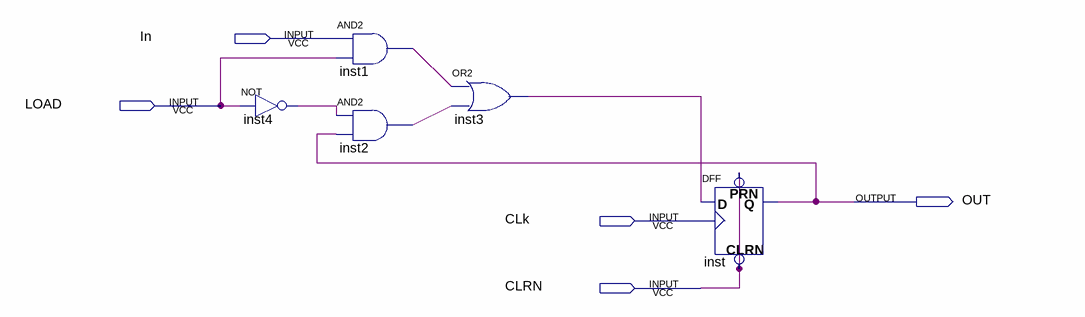
[diagram p0: schematic sheet]
// Quartus schematic onebitreg.bdf as structural Verilog: 5 symbols, 5 pins
module onebitreg (
  input  In,
  input  LOAD,
  input  CLk,
  input  CLRN,
  output OUT
);

  wire inst1_out, inst2_out, inst3_out, inst4_out;

  not inst4 (inst4_out, LOAD);
  and inst1 (inst1_out, In, LOAD);
  and inst2 (inst2_out, inst4_out, OUT);
  or inst3 (inst3_out, inst1_out, inst2_out);
  DFF inst (.CLRN(CLRN), .CLK(CLk), .D(inst3_out), .PRN(CLRN), .Q(OUT));
endmodule
